# Altium schematic sheet suns_wifi_egse_power_supply.SchDoc: Top
size A4; SheetNumber: 1; SheetTotal: 1
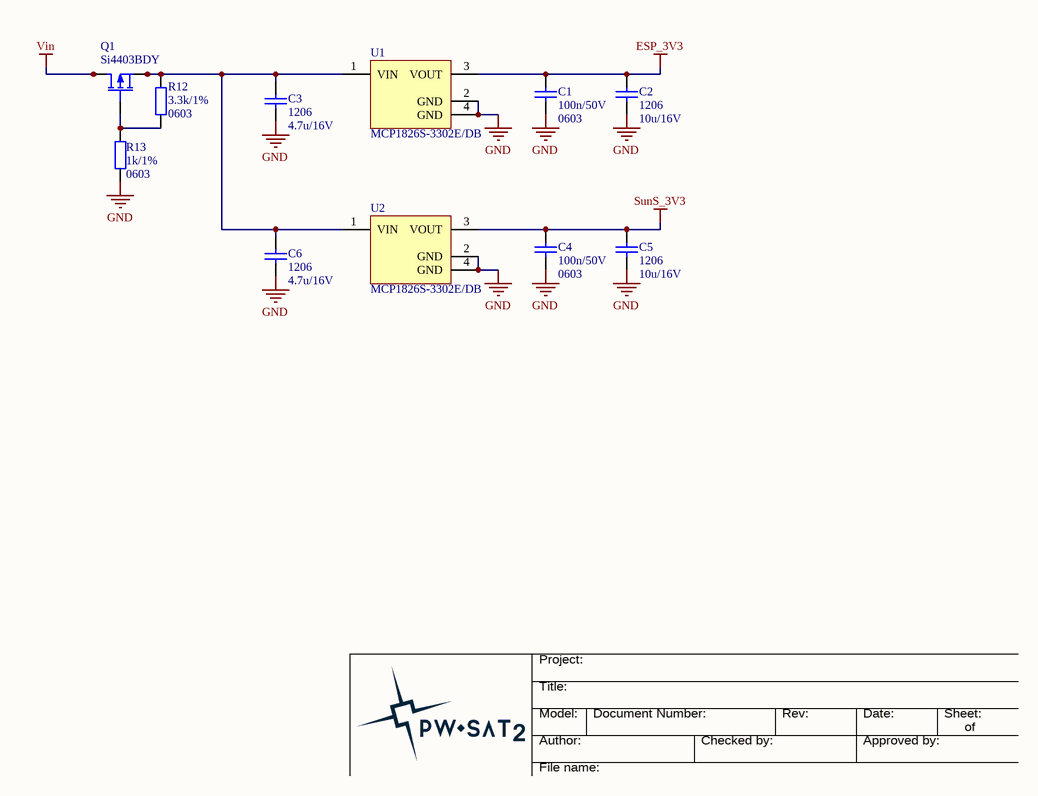
[diagram p0: suns_wifi_egse_power_supply.SchDoc]

## Parts
C1  Package: 0603  [SMD_Capacitor_0603]  (hidden comment: 100n/50V)
C2  Packge: 1206  [SMD_Capacitor_1206]  (hidden comment: 10u/16V)
C3  Packge: 1206  [SMD_Capacitor_1206]  (hidden comment: 4.7u/16V)
C4  Package: 0603  [SMD_Capacitor_0603]  (hidden comment: 100n/50V)
C5  Packge: 1206  [SMD_Capacitor_1206]  (hidden comment: 10u/16V)
C6  Packge: 1206  [SMD_Capacitor_1206]  (hidden comment: 4.7u/16V)
Q1  Si4403BDY  [SOIC-8_M]
R12  Package: 0603  [SMD_Resistor_0603]  (hidden comment: 3.3k/1%)
R13  Package: 0603  [SMD_Resistor_0603]  (hidden comment: 1k/1%)
U1  MCP1826S-3302E/DB  [SOT-223-DB3_M]
U2  MCP1826S-3302E/DB  [SOT-223-DB3_M]

## Nets
ESP_3V3: C1.1 C2.1 U1.3(VOUT)
GND: C1.2 C2.2 C3.2 C4.2 C5.2 C6.2 R13.2 U1.2(GND) U1.4(GND) U2.2(GND) U2.4(GND)
SunS_3V3: C4.1 C5.1 U2.3(VOUT)
Vin: Q1.5(D) Q1.6(D) Q1.7(D) Q1.8(D)
NetC3_1: C3.1 C6.1 Q1.1(S) Q1.2(S) Q1.3(S) R12.1 U1.1(VIN) U2.1(VIN)
NetQ1_4: Q1.4(G) R12.2 R13.1

## Notes on the sheet
- Title:
- Project:
- Author:
- Model:
- Document Number:
- Checked by:
- Rev:
- Date:
- Approved by:
- Sheet:
- of
- File name:

## Library data of the parts
C1 C4 = Cer_C0603T104K5RALTU: Ceramic Cap Kemet COTS 100n/50V X7R 0603; Manufacturer: Kemet; ManufacturerPartNumber: C0603T104K5RALTU; Value: 100n/50V
C2 C3 C5 C6 = Cer_C1206T106K4RACTU: Ceramic Cap Kemet COTS 10u/16V X7R 1206; ManufacturerPartNumber: C1206T106K4RACTU; Manufacturer: Kemet
  C2 C5: Value: 10u/16V
  C3 C6: Value: 4.7u/16V
Q1 = Si4403BDY: P-Channel 1.8 V (G-S) MOSFET; Manufacturer Part Number: Si4403BDY; value: Si4403BDY
R12 R13 = CRCW06031K00FKxxxx: 1k/1% Vishay CRCW 0603 Resistor. 100mW, 100ppm, 75V.; Manufacturer: Vishay; ManufacturerPartNumber: CRCW06031K00FKxxxx
  R12: Value: 3.3k/1%
  R13: Value: 1k/1%
U1 U2 = MCP1826S-3302E/DB: 1000 mA, Low Voltage, Low Quiescent Current LDO Regulator, 3-Pin SOT-223, Extended Temperature; Manufacturer: Microchip; DatasheetVersion: revA, Aug-2007; PackageVersion: revBB, Aug-2009; PackageReference: SOT-223-DB3; PackageDescription: 3-Lead Plastic Small Outline Transistor (DB) [SOT-223]; Supplier 1: Digi-Key; Supplier Part Number 1: MCP1826S-3302E/DB-ND; Supplier 2: Newark; Supplier Part Number 2: 27M0037; Supplier 3: Mouser; Supplier Part Number 3: 579-MCP1826S-3302EDB; Mounting Technology: Surface Mount; PartNumber: MCP1826S-3302E/DB; ComponentLink1Description: Manufacturer URL; ComponentLink1URL: http://www.microchip.com/; ComponentLink2Description: Datasheet; ComponentLink2URL: http://ww1.microchip.com/downloads/en/DeviceDoc/22057a.pdf; ComponentLink3Description: Package Specification; ComponentLink3URL: http://www.microchip.com/stellent/groups/techpub_sg/documents/packagingspec/en012702.pdf